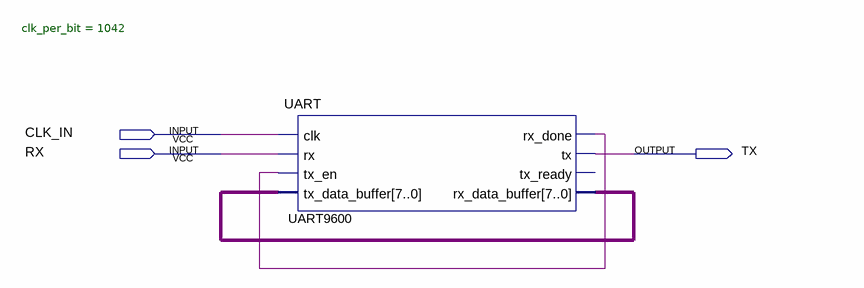
[diagram p0: schematic sheet]
// Quartus schematic UART_loopback.bdf as structural Verilog: 1 symbols, 3 pins
module UART_loopback (
  input  CLK_IN,
  input  RX,
  output TX
);

  wire UART9600_rx_done;
  wire [7:0] UART9600_rx_data_buffer;

  UART #(.clk_per_bit(1042)) UART9600 (
    .clk(CLK_IN), .rx(RX), .tx_en(UART9600_rx_done), .tx_data_buffer(UART9600_rx_data_buffer),
    .rx_done(UART9600_rx_done), .tx(TX), .rx_data_buffer(UART9600_rx_data_buffer));  // open: tx_ready
endmodule
